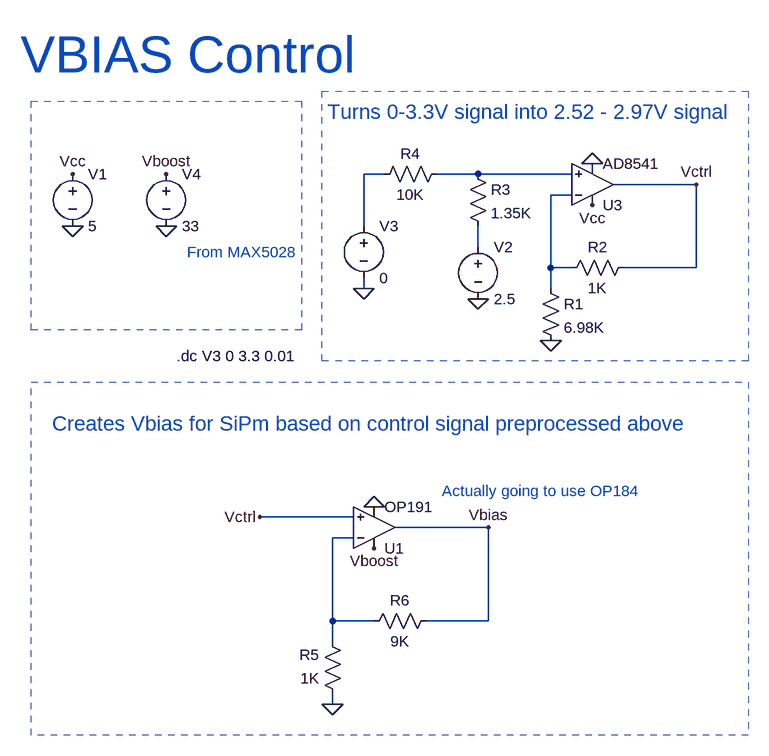
[diagram p0: schematic bias_set.asc]
bias_set.asc, the LTspice schematic file:
Version 4
SHEET 1 4308 1332
WIRE -80 288 -112 288
WIRE 64 288 0 288
WIRE 208 288 64 288
WIRE 400 304 272 304
WIRE 208 320 176 320
WIRE -112 368 -112 288
WIRE 64 400 64 368
WIRE 176 432 176 320
WIRE 208 432 176 432
WIRE 400 432 400 304
WIRE 400 432 288 432
WIRE -112 464 -112 448
WIRE 176 464 176 432
WIRE -128 816 -272 816
WIRE 80 832 -64 832
WIRE -128 848 -160 848
WIRE -160 976 -160 848
WIRE -96 976 -160 976
WIRE 80 976 80 832
WIRE 80 976 -16 976
WIRE -160 1008 -160 976
WIRE -160 1104 -160 1088
FLAG 176 544 0
FLAG -560 368 0
FLAG 64 480 0
FLAG -560 288 Vcc
FLAG -112 464 0
FLAG 240 336 Vcc
FLAG 240 272 0
FLAG 400 304 Vctrl
FLAG -416 368 0
FLAG -416 288 Vboost
FLAG -96 800 0
FLAG -96 864 Vboost
FLAG -160 1104 0
FLAG 80 832 Vbias
FLAG -272 816 Vctrl
SYMBOL res 160 448 R0
SYMATTR InstName R1
SYMATTR Value 6.98K
SYMBOL res 304 416 R90
WINDOW 0 0 56 VBottom 2
WINDOW 3 32 56 VTop 2
SYMATTR InstName R2
SYMATTR Value 1K
SYMBOL res 48 272 R0
SYMATTR InstName R3
SYMATTR Value 1.35K
SYMBOL res 16 272 R90
WINDOW 0 0 56 VBottom 2
WINDOW 3 32 56 VTop 2
SYMATTR InstName R4
SYMATTR Value 10K
SYMBOL voltage -560 272 R0
WINDOW 123 0 0 Left 0
WINDOW 39 0 0 Left 0
SYMATTR InstName V1
SYMATTR Value 5
SYMBOL voltage 64 384 R0
WINDOW 123 0 0 Left 0
WINDOW 39 0 0 Left 0
SYMATTR InstName V2
SYMATTR Value 2.5
SYMBOL voltage -112 352 R0
WINDOW 123 0 0 Left 0
WINDOW 39 0 0 Left 0
SYMATTR InstName V3
SYMATTR Value 0
SYMBOL voltage -416 272 R0
WINDOW 123 0 0 Left 0
WINDOW 39 0 0 Left 0
SYMATTR InstName V4
SYMATTR Value 33
SYMBOL res -144 1104 R180
WINDOW 0 36 76 Left 2
WINDOW 3 36 40 Left 2
SYMATTR InstName R5
SYMATTR Value 1K
SYMBOL res 0 960 R90
WINDOW 0 0 56 VBottom 2
WINDOW 3 32 56 VTop 2
SYMATTR InstName R6
SYMATTR Value 9K
SYMBOL OpAmps\\OP191 -96 896 M180
SYMATTR InstName U1
SYMBOL OpAmps\\AD8541 240 368 M180
SYMATTR InstName U3
TEXT -400 568 Left 2 !.dc V3 0 3.3 0.01
TEXT -168 192 Left 3 ;Turns 0-3.3V signal into 2.52 - 2.97V signal
TEXT -384 408 Left 2 ;From MAX5028
TEXT -592 672 Left 3 ;Creates Vbias for SiPm based on control signal preprocessed above
TEXT -640 104 Left 6 ;VBIAS Control
TEXT 8 776 Left 2 ;Actually going to use OP184
RECTANGLE Normal -208 528 -624 176 2
RECTANGLE Normal 480 1152 -624 608 2
RECTANGLE Normal 480 576 -176 160 2

The netlist it stands for:
* bias_set.asc
R1 N003 0 6.98K
R2 Vctrl N003 1K
R3 N002 N004 1.35K
R4 N002 N001 10K
V1 Vcc 0 5
V2 N004 0 2.5
V3 N001 0 0
V4 Vboost 0 33
R5 0 N005 1K
R6 Vbias N005 9K
XU1 Vctrl N005 Vboost 0 Vbias OP191  ; pins In+ In- V+ V- OUT
XU3 N002 N003 Vcc 0 Vctrl AD8541  ; pins In+ In- V+ V- OUT
.dc V3 0 3.3 0.01
* Turns 0-3.3V signal into 2.52 - 2.97V signal
* From MAX5028
* Creates Vbias for SiPm based on control signal preprocessed above
* VBIAS Control
* Actually going to use OP184
.lib ADI.lib
.backanno
.end